# Altium schematic sheet SCH_ALTIUM_1_2023-11-20.schdoc
size 125 x 91 mm
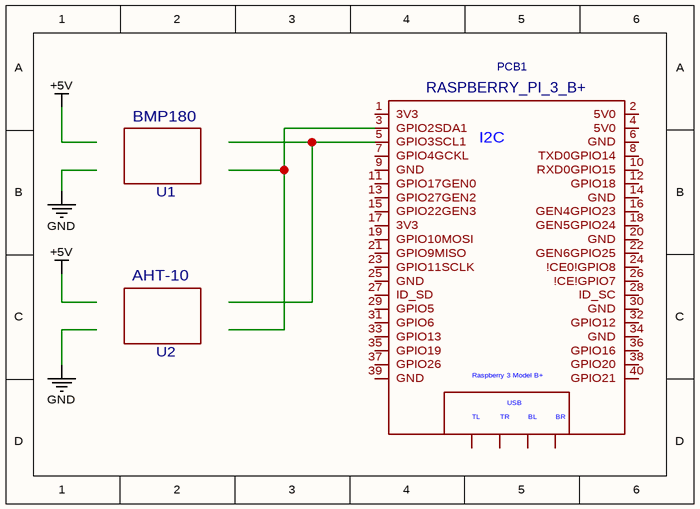
[diagram p0: SCH_ALTIUM_1_2023-11-20.schdoc]

## Parts
PCB1  RASPBERRY_PI_3_B+  [RASPBERRY_PI_B+]

## Nets

Not connected (* = marked no-connect by the designer): PCB1 1(3V3) 2(5V0) 3(GPIO2SDA1) 4(5V0) 5(GPIO3SCL1) 6(GND) 7(GPIO4GCKL) 8(TXD0GPIO14) 9(GND) 10(RXD0GPIO15) 11(GPIO17GEN0) 12(GPIO18) 13(GPIO27GEN2) 14(GND) 15(GPIO22GEN3) 16(GEN4GPIO23) 17(3V3) 18(GEN5GPIO24) 19(GPIO10MOSI) 20(GND) 21(GPIO9MISO) 22(GEN6GPIO25) 23(GPIO11SCLK) 24(!CE0!GPIO8) 25(GND) 26(!CE!GPIO7) 27(ID_SD) 28(ID_SC) 29(GPIO5) 30(GND) 31(GPIO6) 32(GPIO12) 33(GPIO13) 34(GND) 35(GPIO19) 36(GPIO16) 37(GPIO26) 38(GPIO20) 39(GND) 40(GPIO21) PE_BL(BL) PE_BR(BR) PE_TL(TL) PE_TR(TR)

## Notes on the sheet
- BMP180
- (near PCB1) I2C
- U1
- AHT-10
- U2
- (in symbol RASPBERRY_PI_3_B+) Raspberry 3 Model B+; USB

## Library data of the parts
PCB1 = RASPBERRY_PI_3_B+: description: Raspberry Pi B+; timeStamp: 1457727207; spicePre: P; spiceSymbolName: RASPBERRY_PI_B+_HAT